# EAGLE design freiBot_pro_micro_SMD_v1.0 (EAGLE 7.2.0)
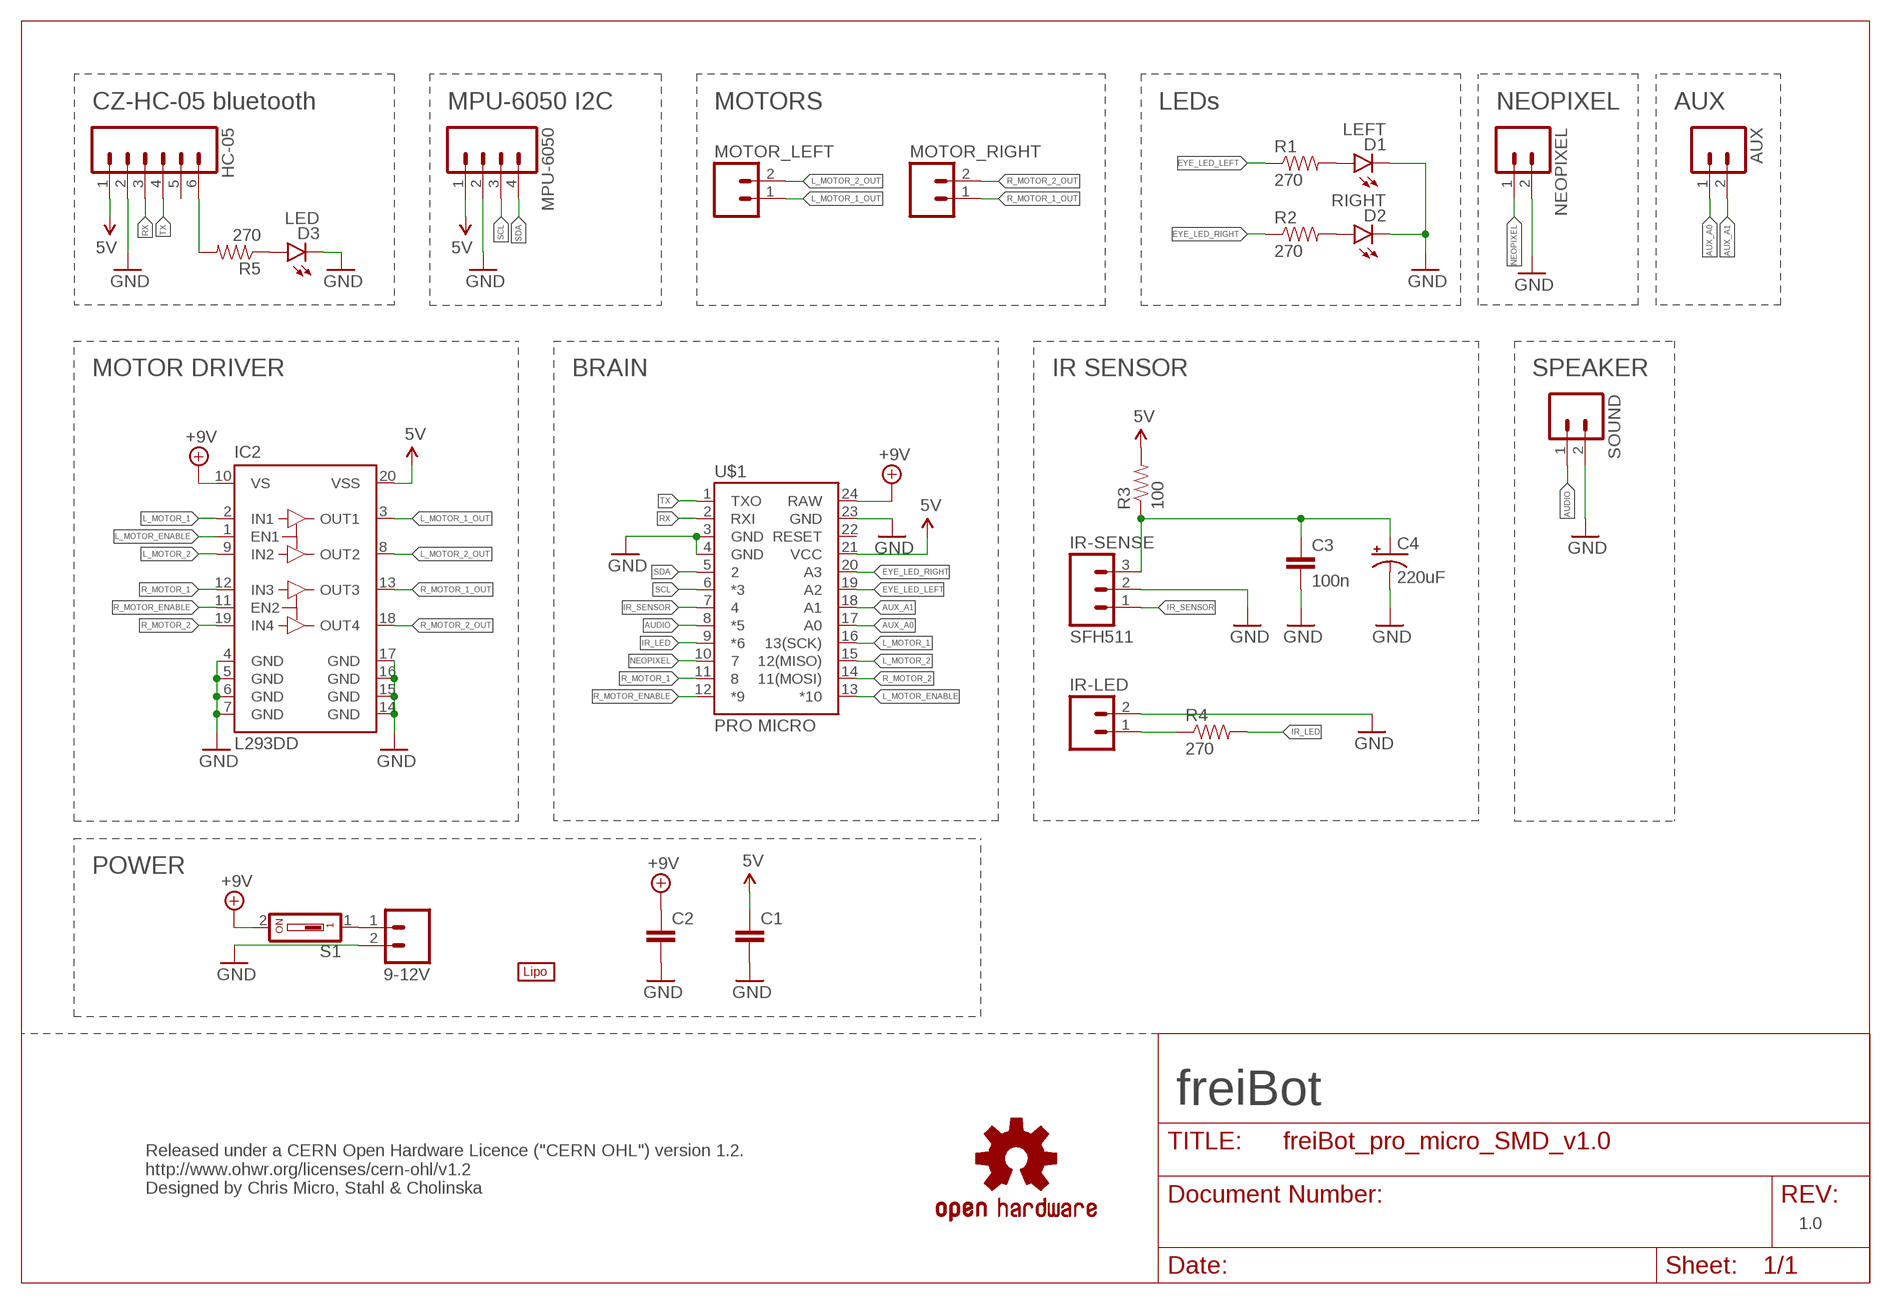
[diagram p0: schematic, sheet 1]

## Parts
9-12V  M025MM  [SCREWTERMINAL-5MM-2]
AUX  M02LOCK_LONGPADS  [1X02_LOCK_LONGPADS]
C1  CAP1206  [1206]
C2  CAP1206  [1206]
C3  100n  CAP1206  [1206]
C4  220uF  CAP_POL1206  [EIA3216]
D1  LEFT  LED3MM  [LED3MM]
D2  RIGHT  LED3MM  [LED3MM]
D3  LED  LED1206  [LED-1206]
HC-05  M06LONGPADS  [1X06_LONGPADS]
IC2  L293DD  [SO20]
IR-LED  M02LOCK_LONGPADS  [1X02_LOCK_LONGPADS]
IR-SENSE  SFH511  M03LONGPADS  [1X03_LONGPADS]
LOGO1  OSHW-LOGOL-COPPER  [OSHW-LOGO-L_COPPER]
MOTOR_LEFT  M025MM  [SCREWTERMINAL-5MM-2]
MOTOR_RIGHT  M025MM  [SCREWTERMINAL-5MM-2]
MPU-6050  M04LONGPADS  [1X04_LONGPADS]
NEOPIXEL  M02LOCK_LONGPADS  [1X02_LOCK_LONGPADS]
R1  270  RESISTOR1206  [1206]
R2  270  RESISTOR1206  [1206]
R3  100  RESISTOR1206  [1206]
R4  270  RESISTOR1206  [1206]
R5  270  RESISTOR1206  [1206]
S1  SD4-01  [SD4-01]
SOUND  M02LOCK_LONGPADS  [1X02_LOCK_LONGPADS]
U$1  PRO MICRO  ARDUINO_PRO_MICRO  [ARDUINO_PRO_MICRO]
U$2  LIPO-OUTLINE2000  [LIPO-2000]

## Nets
5V: C1.1 HC-05.1 IC2.20(VSS) MPU-6050.1 R3.2 U$1.21(VCC)
+9V: C2.1 IC2.10(VS) S1.2 U$1.24(RAW)
AUDIO: SOUND.1 U$1.8(*5)
AUX_A0: AUX.1 U$1.17(A0)
AUX_A1: AUX.2 U$1.18(A1)
EYE_LED_LEFT: R1.1 U$1.19(A2)
EYE_LED_RIGHT: R2.1 U$1.20(A3)
GND: 9-12V.2 C1.2 C2.2 C3.2 C4.C(-) D1.K(C) D2.K(C) D3.C HC-05.2 IC2.4(GND) IC2.5(GND) IC2.6(GND) IC2.7(GND) IC2.14(GND) IC2.15(GND) IC2.16(GND) IC2.17(GND) IR-LED.2 IR-SENSE.2 MPU-6050.2 NEOPIXEL.2 SOUND.2 U$1.3(GND) U$1.4(GND) U$1.23(GND)
IR_LED: R4.2 U$1.9(*6)
IR_SENSOR: IR-SENSE.1 U$1.7
L_MOTOR_1: IC2.2(IN1) U$1.16(13(SCK))
L_MOTOR_1_OUT: IC2.3(OUT1) MOTOR_LEFT.1
L_MOTOR_2: IC2.9(IN2) U$1.15(12(MISO))
L_MOTOR_2_OUT: IC2.8(OUT2) MOTOR_LEFT.2
L_MOTOR_ENABLE: IC2.1(EN1) U$1.13(*10)
N$1: D1.A R1.2
N$2: D2.A R2.2
N$3: D3.A R5.1
N$4: IR-LED.1 R4.1
N$5: HC-05.6 R5.2
N$6: C3.1 C4.A(+) IR-SENSE.3 R3.1
N$7: 9-12V.1 S1.1
NEOPIXEL: NEOPIXEL.1 U$1.10
R_MOTOR_1: IC2.12(IN3) U$1.11
R_MOTOR_1_OUT: IC2.13(OUT3) MOTOR_RIGHT.1
R_MOTOR_2: IC2.19(IN4) U$1.14(11(MOSI))
R_MOTOR_2_OUT: IC2.18(OUT4) MOTOR_RIGHT.2
R_MOTOR_ENABLE: IC2.11(EN2) U$1.12(*9)
RX: HC-05.3 U$1.2(RXI)
SCL: MPU-6050.3 U$1.6(*3)
SDA: MPU-6050.4 U$1.5
TX: HC-05.4 U$1.1(TXO)
Unconnected: HC-05.5 U$1.22(RESET)

## Notes on the sheet
- CZ-HC-05 bluetooth | MPU-6050 I2C | MOTORS | LEDs | NEOPIXEL | AUX
- MOTOR DRIVER | BRAIN | IR SENSOR | SPEAKER
- POWER
- freiBot
- Released under a CERN Open Hardware Licence ("CERN OHL") version 1.2.
  http://www.ohwr.org/licenses/cern-ohl/v1.2
  Designed by Chris Micro, Stahl & Cholinska
- 1.0

## Library data of the parts
9-12V MOTOR_LEFT MOTOR_RIGHT = SparkFun-Connectors:M02: Standard 2-pin 0.1" header. Use with - straight break away headers ( PRT-00116) - right angle break away headers (PRT-00553) - swiss pins (PRT-00743) - machine pins (PRT-00117) - female headers (PRT-00115) Molex polarized connector foot print use with: PRT-08233 with associated crimp pins and housings. 2.54_SCREWTERM for use with PRT-10571. 3.5mm Screw Terminal footprints for PRT-08084 5mm Screw Terminal footprints for use with PRT-08432; STOREFRONT_ID: PRT-08432
AUX IR-LED NEOPIXEL SOUND = SparkFun-Connectors:M02: Standard 2-pin 0.1" header. Use with - straight break away headers ( PRT-00116) - right angle break away headers (PRT-00553) - swiss pins (PRT-00743) - machine pins (PRT-00117) - female headers (PRT-00115) Molex polarized connector foot print use with: PRT-08233 with associated crimp pins and housings. 2.54_SCREWTERM for use with PRT-10571. 3.5mm Screw Terminal footprints for PRT-08084 5mm Screw Terminal footprints for use with PRT-08432
C1-C3 = SparkFun-Capacitors:CAP: Capacitor Standard 0603 ceramic capacitor, and 0.1" leaded capacitor.
C4 = SparkFun-Capacitors:CAP_POL: Capacitor Polarized These are standard SMD and PTH capacitors. Normally 10uF, 47uF, and 100uF in electrolytic and tantalum varieties. Always verify the external diameter of the through hole cap, it varies with capacity, voltage, and manufacturer. The EIA devices should be standard.
D1-D3 = SparkFun-LED:LED: LEDs Standard schematic elements and footprints for 5mm, 3mm, 1206, and 0603 sized LEDs. 5mm - Spark Fun Electronics SKU : COM-00529 (and others)
HC-05 = SparkFun-Connectors:M06: Header 6 Standard 6-pin 0.1" header. Use with straight break away headers (SKU : PRT-00116), right angle break away headers (PRT-00553), swiss pins (PRT-00743), machine pins (PRT-00117), and female headers (PRT-00115). Molex polarized connector foot print use with SKU : PRT-08094 with associated crimp pins and housings. NOTES ON THE VARIANTS LOCK and LOCK_LONGPADS... This footprint was designed to help hold the alignment of a through-hole component (i.e. 6-pin header) while soldering it into place. You may notice that each hole has been shifted either up or down by 0.005 of an inch from it's more standard position (which is a perfectly straight line). This slight alteration caused the pins (the squares in the middle) to touch the edges of the holes. Because they are alternating, it causes a "brace" to hold the component in place. 0.005 has proven to be the perfect amount of "off-center" position when using our standard breakaway headers. Although looks a little odd when you look at the bare footprint, once you have a header in there, the alteration is very hard to notice. Also,if you push a header all the way into place, it is covered up entirely on the bottom side. This idea of altering the position of holes to aid alignment will be further integrated into the Sparkfun Library for other footprints. It can help hold any component with 3 or more connection pins.
IC2 = st-microelectronics:L293DD: PUSH-PULL FOUR CHANNEL DRIVER WITH DIODES Source: http://www.st.com/stonline/books/pdf/docs/1330.pdf; OC_FARNELL: unknown
IR-SENSE = SparkFun-Connectors:M03: Header 3 Standard 3-pin 0.1" header. Use with straight break away headers (SKU : PRT-00116), right angle break away headers (PRT-00553), swiss pins (PRT-00743), machine pins (PRT-00117), and female headers (PRT-00115). Molex polarized connector foot print use with SKU : PRT-08232 with associated crimp pins and housings.
LOGO1 = SparkFun-Aesthetics:OSHW-LOGO: Open Source Hardware Logo This logo indicates the piece of hardware it is found on incorporates a OSHW license and/or adheres to the definition of open source hardware found here: http://freedomdefined.org/OSHW
MPU-6050 = SparkFun-Connectors:M04: Header 4 Standard 4-pin 0.1" header. Use with straight break away headers (SKU : PRT-00116), right angle break away headers (PRT-00553), swiss pins (PRT-00743), machine pins (PRT-00117), and female headers (PRT-00115). Molex polarized connector foot print use with SKU : PRT-08231 with associated crimp pins and housings. 1MM SMD Version SKU: PRT-10208
R1-R5 = SparkFun-Resistors:RESISTOR: Resistor Basic schematic elements and footprints for 0603, 1206, and PTH resistors.
S1 = switch-dil:SD4-01: DIL/CODE SWITCH; OC_FARNELL: unknown; OC_NEWARK: unknown
U$1 = SparkFun-Boards:ARDUINO_PRO_MICRO
U$2 = SparkFun-Electromechanical:LIPO-OUTLINE: Outlines for common LiPo batteries sold by SparkFun. For fit only- no pads or connectors!

## Board
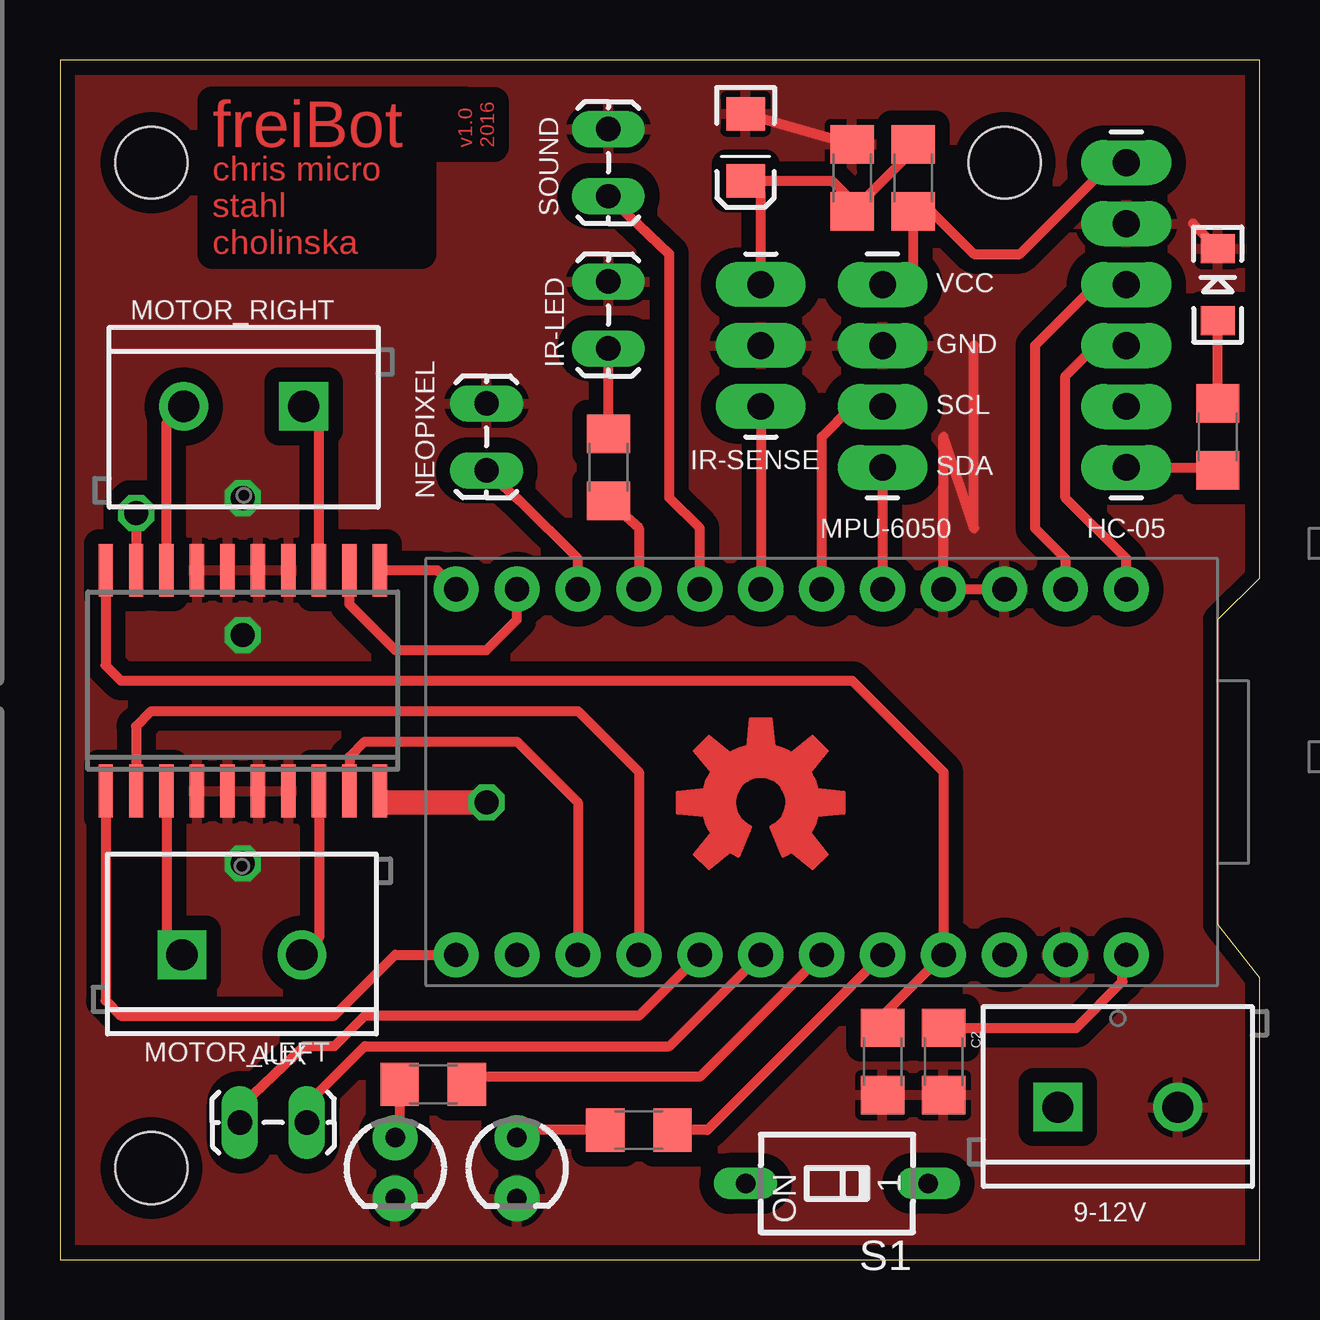
[diagram p1: board, top side]
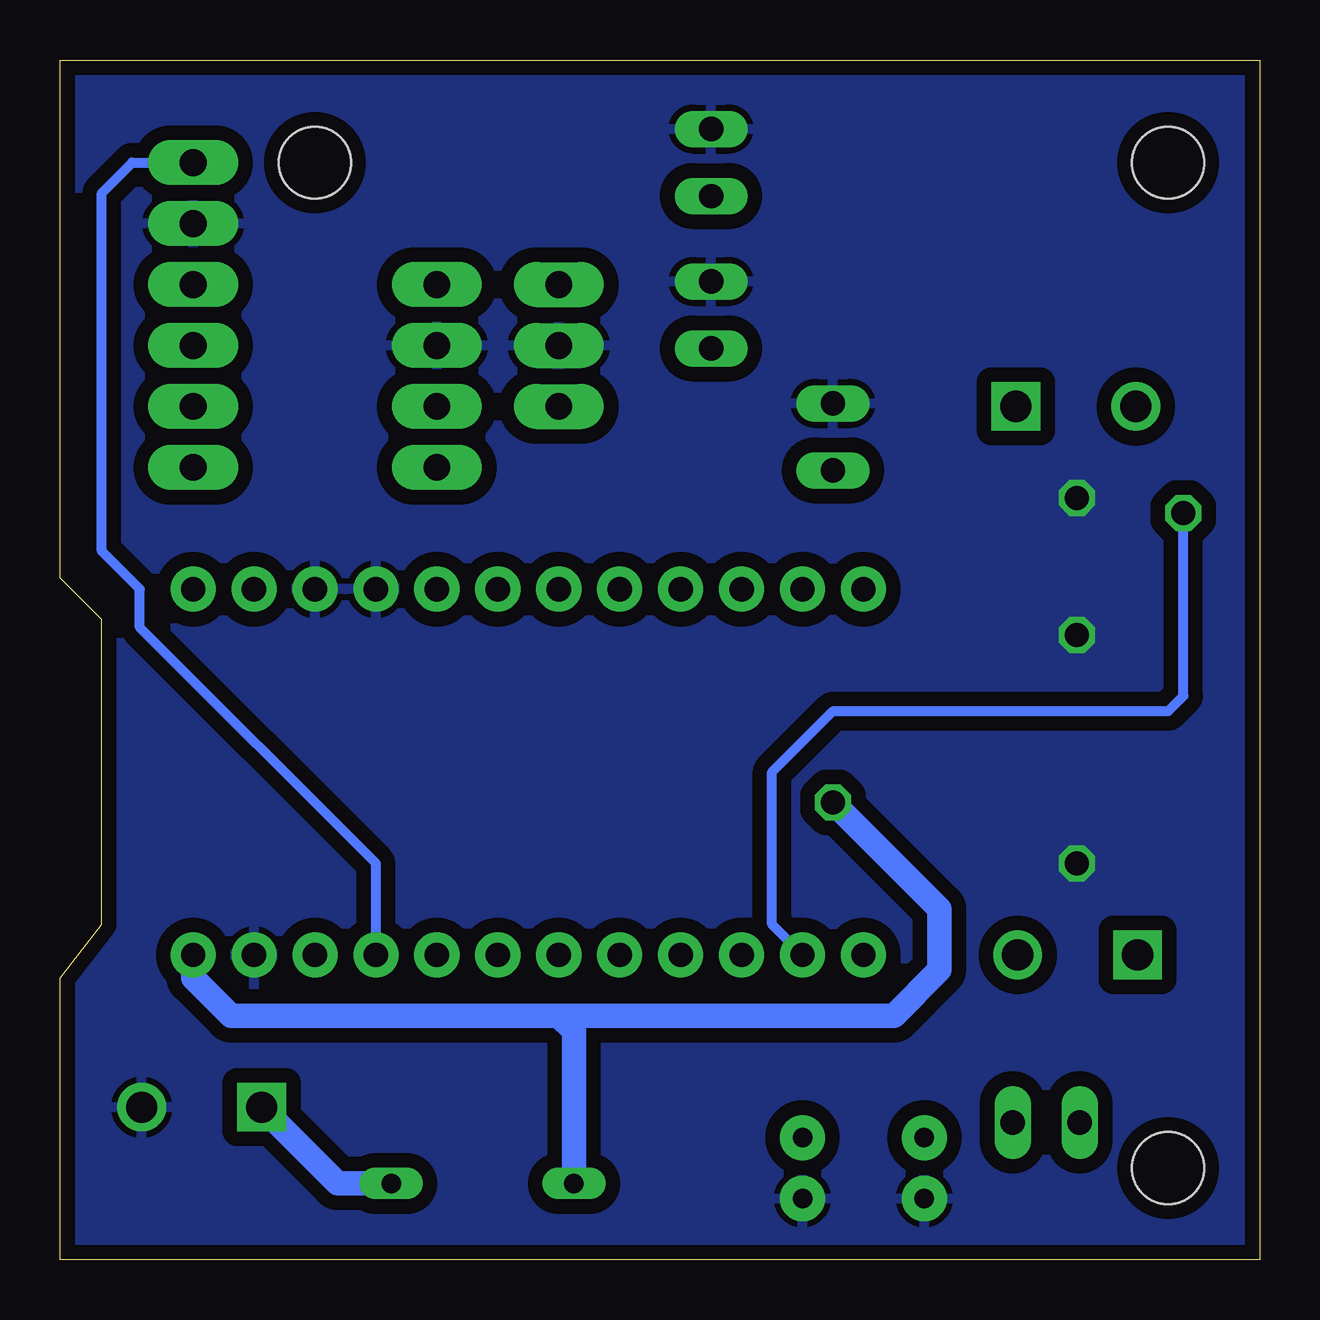
[diagram p2: board, bottom side, seen from below]

Size 50 x 50 mm. Coordinates in mm from the lower left corner, seen from the top.
Outline: 0,0 50,0 50,11.74 48.26,13.97 48.26,26.67 50,28.41 50,50 0,50 0,0
Copper layers (1*16): Top 0.035mm / dielectric 1.5mm / Bottom 0.035mm
Design rules "SeeedStudio_2layer_DRU_no_angle_20140221": minimum track width 6mil, minimum drill 12mil, track to track 6mil, track to pad 6mil, pad to pad 6mil, via to via 6mil, smd to smd 0mil, copper to edge 10mil, drill to drill 10mil, minimum pad ring 10mil, minimum via ring 6mil, stop-mask expansion 2mil, vias tented up to drill 100mil, thermal gap 10mil
Holes 3 mm at 3.81,45.72 3.81,3.81 39.37,45.72

### Footprints (pad centres in the part's own frame; a part is rotated, then mirrored left to right if it is on the bottom)
SCREWTERMINAL-5MM-2 = drill 1.3 pad 2.032 square: 1 0,0 | drill 1.3 pad 2.032: 2 5,0
1X02_LOCK_LONGPADS = drill 1.016 long: 1 -0.127,0; 2 2.667,0
1206 = smd 1.6 x 1.8: 1 -1.4,0; 2 1.4,0
EIA3216 = smd 1.4 x 1.6: A 1.4,0; C -1.4,0
LED3MM = drill 0.813 pad 1.88: A -1.27,0; K 1.27,0
LED-1206 = smd 1.2 x 1.4: A -1.5,0; C 1.5,0
1X06_LONGPADS = drill 1.118 pad 1.88 long: 1 0,0; 2 2.54,0; 3 5.08,0; 4 7.62,0; 5 10.16,0; 6 12.7,0
SO20 = smd 0.6 x 2.2: 1 -5.715,-4.6; 2 -4.445,-4.6; 3 -3.175,-4.6; 4 -1.905,-4.6; 5 -0.635,-4.6; 6 0.635,-4.6; 7 1.905,-4.6; 8 3.175,-4.6; 9 4.445,-4.6; 10 5.715,-4.6; 11 5.715,4.6; 12 4.445,4.6; 13 3.175,4.6; 14 1.905,4.6; 15 0.635,4.6; 16 -0.635,4.6; 17 -1.905,4.6; 18 -3.175,4.6; 19 -4.445,4.6; 20 -5.715,4.6
1X03_LONGPADS = drill 1.118 pad 1.88 long: 1 0,0; 2 2.54,0; 3 5.08,0
1X04_LONGPADS = drill 1.118 pad 1.88 long: 1 0,0; 2 2.54,0; 3 5.08,0; 4 7.62,0
SD4-01 = drill 0.813 long: 1 0,-3.81; 2 0,3.81
ARDUINO_PRO_MICRO = drill 1.016 pad 1.88: 1 -7.62,12.7; 2 -7.62,10.16; 3 -7.62,7.62; 4 -7.62,5.08; 5 -7.62,2.54; 6 -7.62,0; 7 -7.62,-2.54; 8 -7.62,-5.08; 9 -7.62,-7.62; 10 -7.62,-10.16; 11 -7.62,-12.7; 12 -7.62,-15.24; 13 7.62,-15.24; 14 7.62,-12.7; 15 7.62,-10.16; 16 7.62,-7.62; 17 7.62,-5.08; 18 7.62,-2.54; 19 7.62,0; 20 7.62,2.54; 21 7.62,5.08; 22 7.62,7.62; 23 7.62,10.16; 24 7.62,12.7

### Placement (x,y rotation side)
9-12V  41.59,6.35 0 top
AUX  7.62,5.71 0 top
C1  34.29,8.26 270 top
C2  36.83,8.26 270 top
C3  33.02,45.09 90 top
C4  28.57,46.35 270 top
D1  13.97,3.81 270 top
D2  19.05,3.81 270 top
D3  48.26,40.64 90 top
HC-05  44.45,45.72 270 top
IC2  7.62,24.13 0 top
IR-LED  22.86,38.1 90 top
IR-SENSE  29.21,35.56 90 top
LOGO1  29.21,19.05 0 top
MOTOR_LEFT  5.08,12.7 0 top
MOTOR_RIGHT  10.16,35.56 180 top
MPU-6050  34.29,40.64 270 top
NEOPIXEL  17.78,33.02 90 top
R1  15.56,7.3 180 top
R2  24.13,5.4 180 top
R3  35.56,45.09 270 top
R4  22.86,33.02 270 top
R5  48.26,34.29 270 top
S1  32.38,3.17 90 top
SOUND  22.86,44.45 90 top
U$1  31.75,20.32 270 top
U$2  54.61,-2.54 0 top  (outside the outline)

### Tracks (layer width: path | path; a pad name or v marks a point on that pad's centre or on a via)
5V
  Top 0.406: MPU-6050.1 34.92,40.64 35.56,41.27 R3.2 36.33,43.69 38.1,41.91 40.01,41.91 43.81,45.72 HC-05.1 | IC2.20 1.91,24.77 2.54,24.13 33.02,24.13 36.83,20.32 U$1.21 34.29,10.16 C1.1
  Bottom 0.406: U$1.21 36.83,16.51 46.67,26.35 46.67,27.94 48.26,29.53 48.26,44.45 46.99,45.72 HC-05.1
+9V  (via drill 1)
  Top 0.406: 13.97,19.05 IC2.10 | C2.1 42.36,9.65 44.29,11.59 44.29,12.54 U$1.24
  Top 1.016: v17.78,19.05 13.97,19.05 13.65,19.05
  Bottom 1.016: 29.21,10.16 42.86,10.16 44.45,11.75 U$1.24 | 29.21,10.16 15.24,10.16 13.34,12.06 13.34,14.61 v17.78,19.05 | S1.2 28.57,9.53 29.21,10.16
AUDIO
  Top 0.406: U$1.8 26.67,30.48 25.4,31.75 25.4,41.91 SOUND.1
AUX_A0
  Top 0.406: U$1.17 24.13,10.16 12.7,10.16 11.43,8.89 10.16,8.89 7.62,6.48 AUX.1
AUX_A1
  Top 0.406: AUX.2 10.16,6.35 12.7,8.89 25.4,8.89 U$1.18
EYE_LED_LEFT
  Top 0.406: R1.1 17.78,7.62 26.67,7.62 U$1.19
EYE_LED_RIGHT
  Top 0.406: U$1.20 26.99,5.4 R2.1
GND  (via drill 1)
  Top 0.406: U$1.3 U$1.4 36.83,34.29 38.1,30.48 38.1,38.1 | 47.22,43.18 D3.C | C4.C C3.2
  other vias: 7.62,16.51 7.62,31.75 7.62,26.04
  pour Top (isolate 0.61): -0.95,50.8 50.8,50.8 50.8,-1.27 -1.27,-1.27
  pour Bottom (isolate 0.61): -0.95,50.8 50.8,50.8 50.8,-1.27 -1.27,-1.27
IR_LED
  Top 0.406: R4.2 24.13,30.48 U$1.9
IR_SENSOR
  Top 0.406: IR-SENSE.1 U$1.7
L_MOTOR_1
  Top 0.406: U$1.16 24.13,20.32 21.59,22.86 3.81,22.86 3.17,22.23 IC2.2
L_MOTOR_1_OUT
  Top 0.406: MOTOR_LEFT.1 4.45,13.34 IC2.3
L_MOTOR_2
  Top 0.406: U$1.15 21.59,19.05 19.05,21.59 12.7,21.59 12.06,20.95 IC2.9
L_MOTOR_2_OUT
  Top 0.406: MOTOR_LEFT.2 10.79,13.41 IC2.8
L_MOTOR_ENABLE
  Top 0.406: U$1.13 13.97,12.7 11.43,10.16 2.54,10.16 1.91,10.79 IC2.1
N$1
  Top 0.406: R1.2 14.16,5.27 D1.A
N$2
  Top 0.406: R2.2 19.37,5.4 D2.A
N$3
  Top 0.406: R5.1 D3.A
N$4
  Top 0.406: R4.1 IR-LED.1
N$5
  Top 0.406: HC-05.6 48.13,33.02 R5.2
N$6
  Top 0.406: IR-SENSE.3 29.21,44.45 C4.A 32.2,44.95 33.02,44.13 C3.1 35.56,46.23 R3.1
N$7
  Bottom 1.016: S1.1 38.42,3.17 9-12V.1
NEOPIXEL
  Top 0.406: U$1.10 21.59,29.21 19.18,31.62 NEOPIXEL.1
R_MOTOR_1
  Top 0.406: U$1.11 19.05,26.67 17.78,25.4 13.97,25.4 12.06,27.3 IC2.12
R_MOTOR_1_OUT
  Top 0.406: MOTOR_RIGHT.1 10.79,34.92 IC2.13
R_MOTOR_2  (via drill 1)
  Top 0.406: v3.17,31.11 IC2.19
  Bottom 0.406: U$1.14 20.32,13.97 20.32,20.32 17.78,22.86 3.81,22.86 3.17,23.5 v3.17,31.11
R_MOTOR_2_OUT
  Top 0.406: MOTOR_RIGHT.2 4.45,34.84 IC2.18
R_MOTOR_ENABLE
  Top 0.406: IC2.11 15.72,28.73 U$1.12
RX
  Top 0.406: HC-05.3 43.18,40.64 40.64,38.1 40.64,30.48 41.91,29.21 U$1.2
SCL
  Top 0.406: U$1.6 31.75,34.29 33.02,35.56 MPU-6050.3
SDA
  Top 0.406: MPU-6050.4 U$1.5
TX
  Top 0.406: U$1.1 44.45,29.21 41.91,31.75 41.91,36.83 43.18,38.1 HC-05.4

### Text on the board
Top: freiBot | v1.0 / 2016 | chris micro / stahl / cholinska
tNames: VCC | GND | SCL | SDA
tDocu: A0 | A1 | + | -